# EasyEDA Pro project ProPrj_F446V2.0.epro, board PCB5
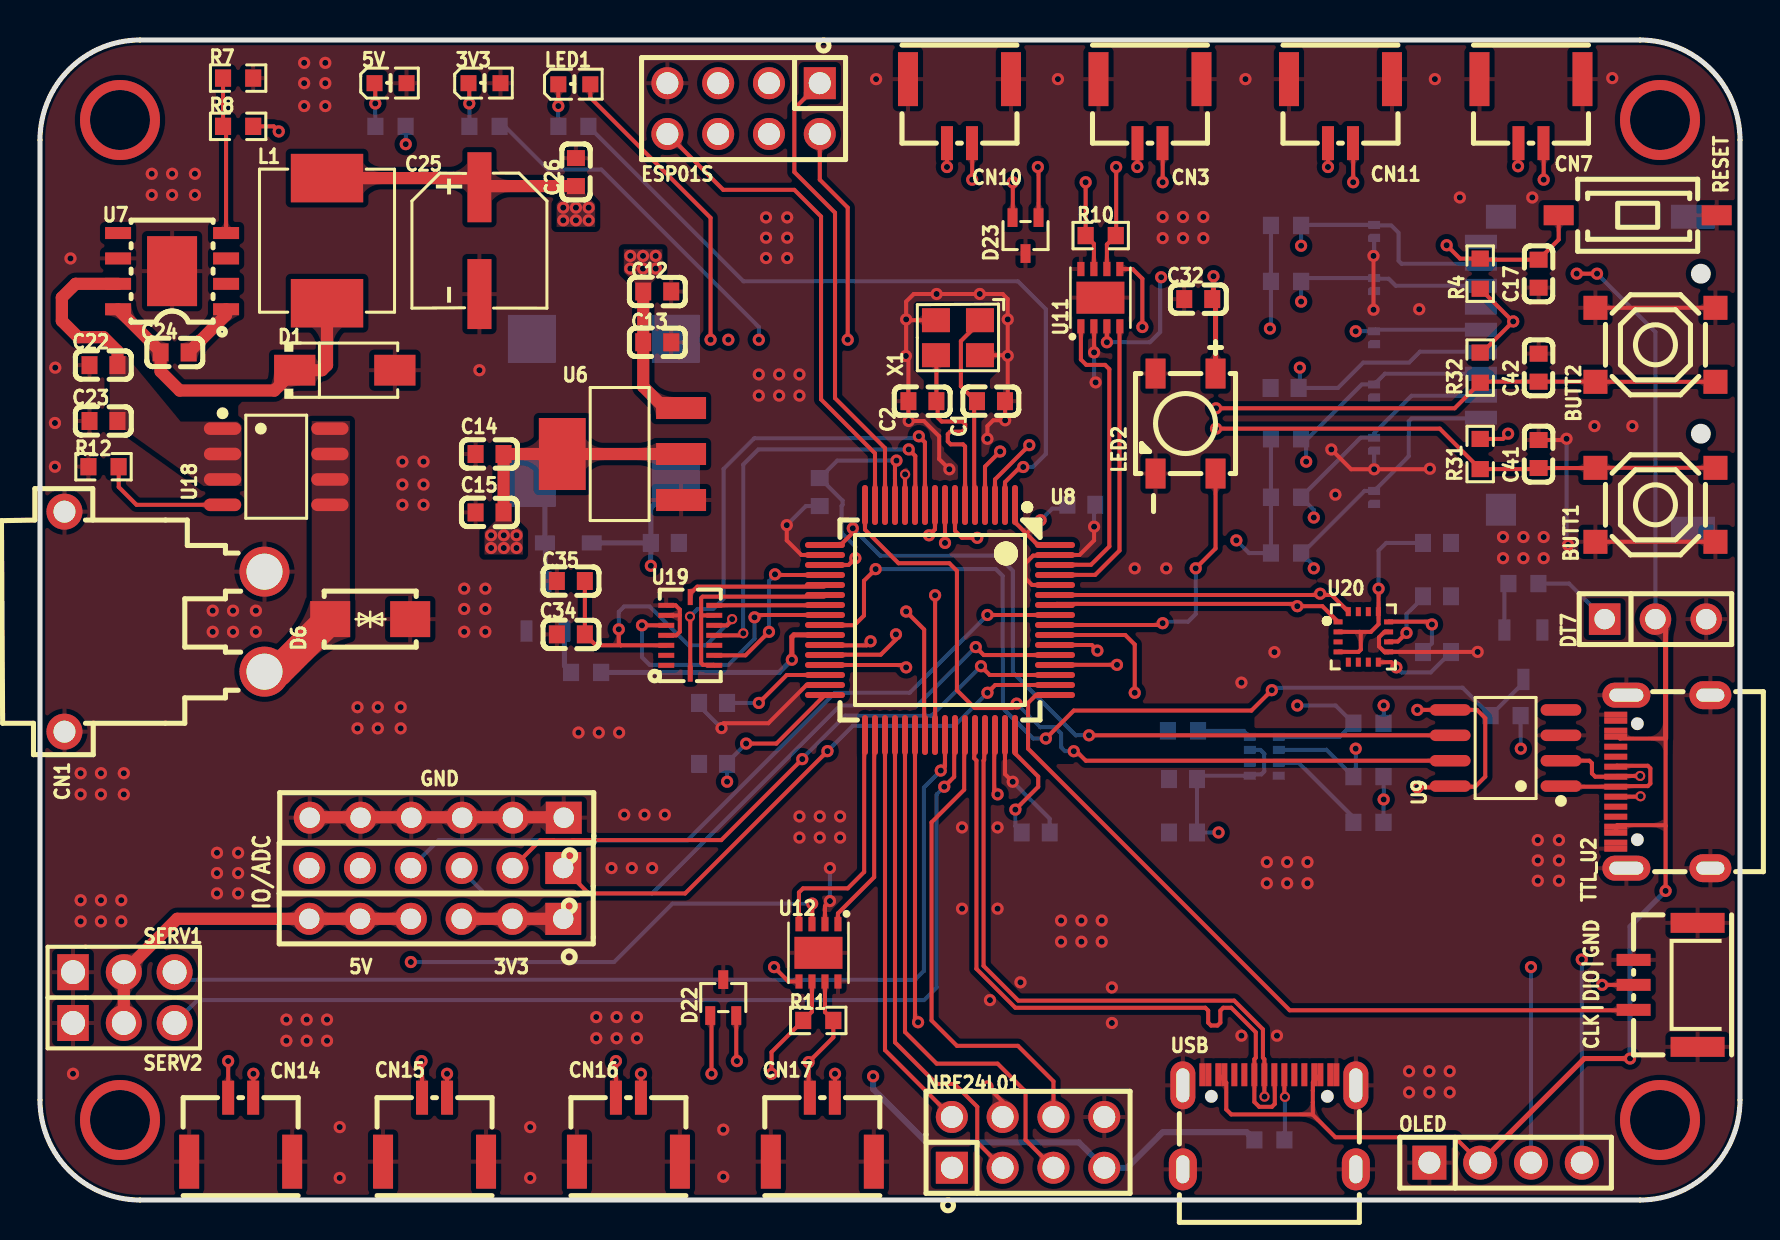
[diagram p1: board, top side]
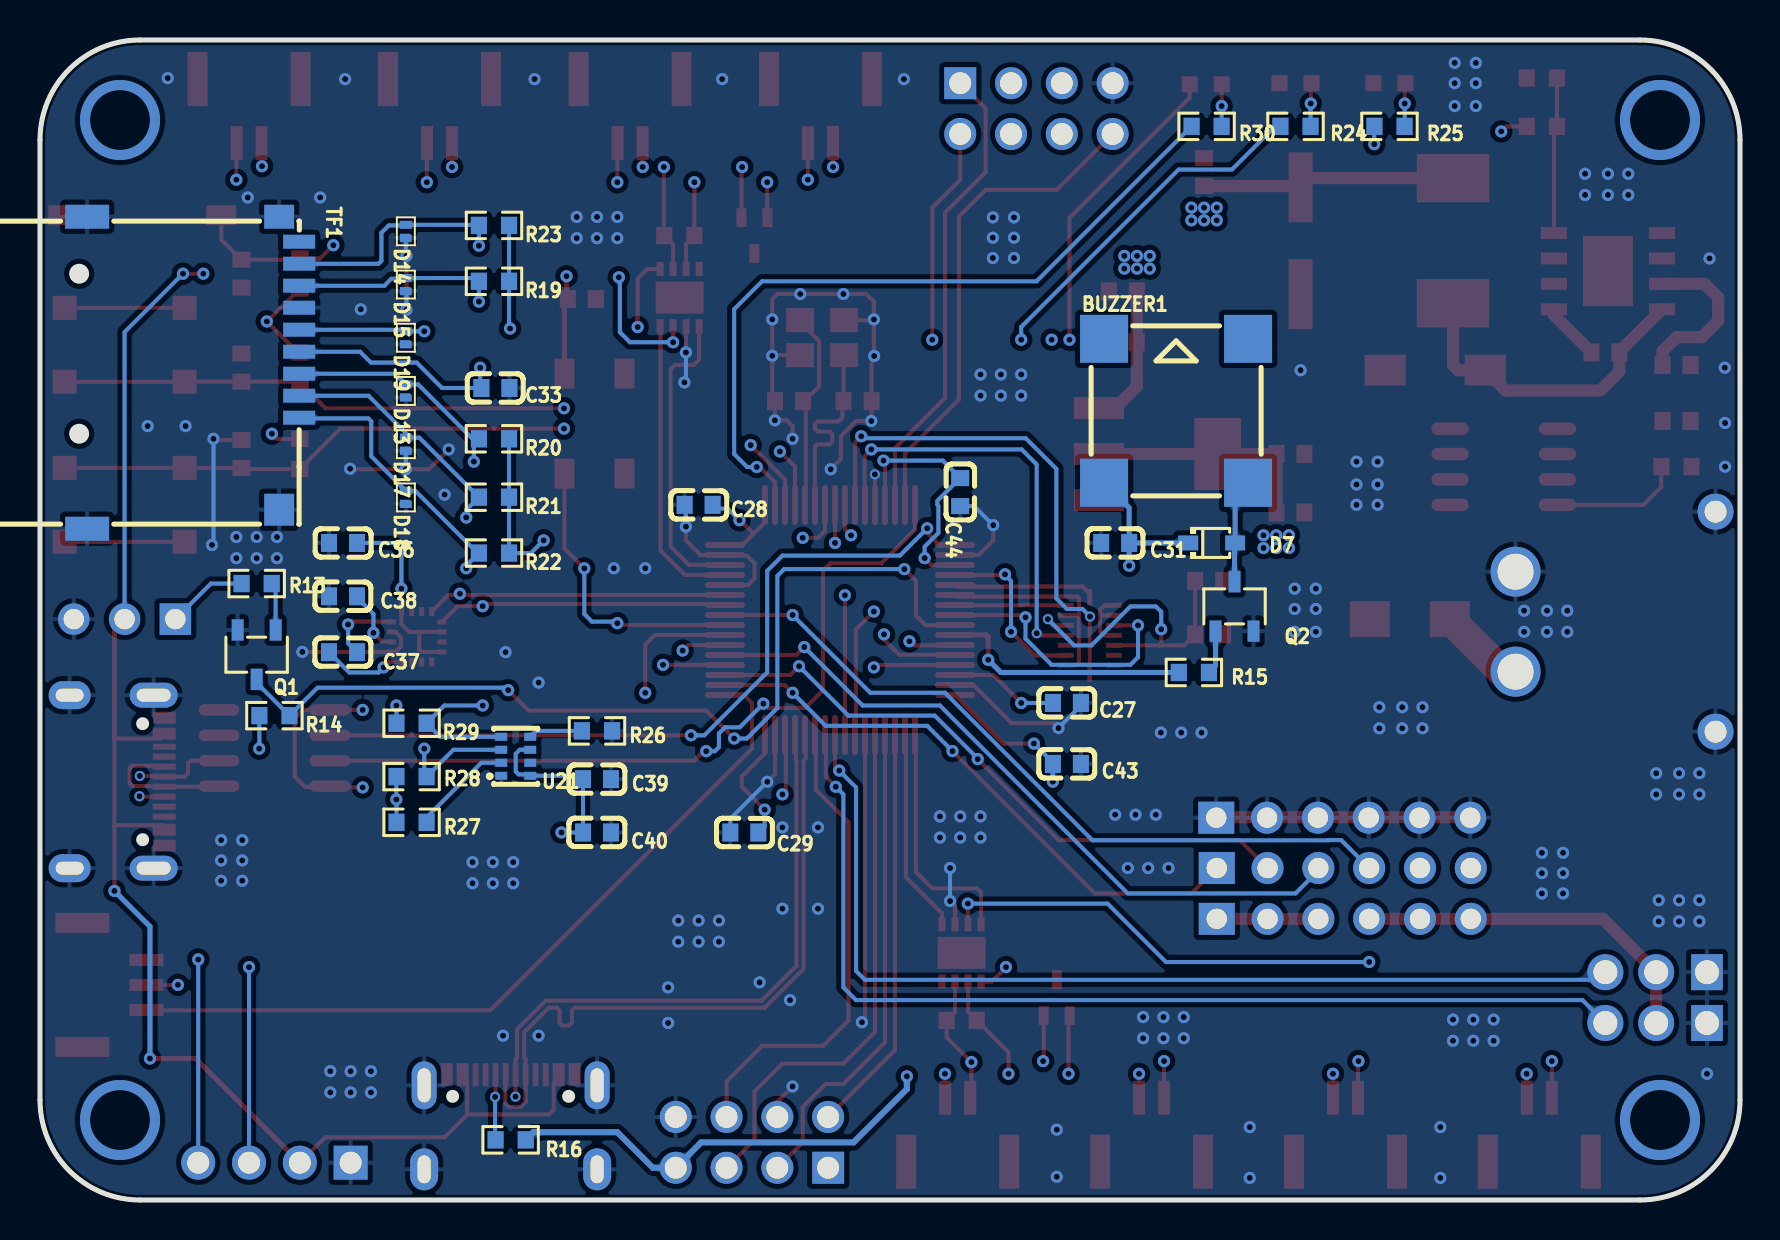
[diagram p2: board, bottom side, seen from below]

Outline 85 x 58 mm; copper layers: Top Layer, GND1, SIG, POW, GND2, Bottom Layer. Coordinates in mm from the lower left corner of the outline.
Outline path: 0,53 0,5 arc(1.46,1.46) 5,0 80,0 arc(83.54,1.46) 85,5 85,53 arc(83.54,56.54) 80,58 5,58 arc(1.46,56.54) 0,53
Stack: Top Layer 0.035mm 外层铜厚1oz / Dielectric1 0.0994mm 3313 RC57% 4.2mil / GND1 0.0152mm 内层铜厚 / Dielectric2 0.55mm 0.55mm H/H No copper / SIG 0.0152mm 内层铜厚 / Dielectric3 0.1088mm 2116 RC54% 4.9mil / POW 0.0152mm 内层铜厚 / Dielectric4 0.55mm 0.55mm H/H No copper / GND2 0.0152mm 内层铜厚 / Dielectric5 0.0994mm 3313 RC57% 4.2mil / Bottom Layer 0.035mm 外层铜厚1oz

## Design rules (mm)
net OSC_IN: osc
net OSC_OUT: osc
net USB_DP: usb
net USB_DM: usb
net TTL_DP: ttl
net TTL_DM: ttl
template: 自定义配置
spacing copperThickness1oz (default): track to track 0.102, other pairs 0.152 to 0.3
spacing copperThickness2oz: track to track 0.203, other pairs 0.152 to 0.3
track width copperThickness1oz (default): min 0.127, default 0.203, max 2.54
track width copperThickness2oz: min 0.203, default 0.254, max 2.54
differential pair differentialPair (default): width min 0.127, default 0.203, max 2.54; gap min 0.152, default 0.152
via viaSize (default): diameter min 0.406, default 0.61, max 10; hole min 0.305, default 0.305, max 6.299

## Placement (name value [footprint] x y rotation side)
3V3  -  [hdr-th_6p-p2.54-v-f]  19.84 19.11 180 top
3V3#2  -  [LED0603-R-RD_WHITE]  22.22 55.84 0 top
5V  -  [hdr-th_6p-p2.54-v-f]  19.81 14.06 180 top
5V#2  -  [LED0603-R-RD_WHITE]  17.53 55.84 0 top
BUTT1  SW-KEY轻触开关贴片四脚按键  [KEY-SMD_4P-L5.1-W5.1-P3.70-LS6.5]  80.77 34.76 0 top
BUTT2  SW-KEY轻触开关贴片四脚按键  [KEY-SMD_4P-L5.1-W5.1-P3.70-LS6.5]  80.77 42.76 180 top
BUZZER1  2.7kHz  [BUZ-SMD_4P-L8.5-W8.5-P8.50-BR]  28.19 39.46 180 bottom
C1  20pF  [C0603]  47.55 39.94 0 top
C2  20pF  [C0603]  44.12 39.94 0 top
C12  10uF  [C0603]  30.86 45.43 180 top
C13  100nF  [C0603]  30.86 42.89 180 top
C14  10uF  [C0603]  22.48 37.3 0 top
C15  100nF  [C0603]  22.48 34.38 0 top
C17  1uF  [C0603]  74.93 46.32 90 top
C22  100nF  [C0603]  3.17 41.74 0 top
C23  10uF  [C0603]  3.17 38.95 0 top
C24  100nF  [C0603]  6.73 42.38 180 top
C25  220uF  [CAP-SMD_BD6.3-L6.6-W6.6-LS7.2-FD]  21.97 47.97 270 top
C26  100nF  [C0603]  26.8 51.4 270 top
C27  2.2uF  [C0603]  33.66 24.85 180 bottom
C28  100nF  [C0603]  52.07 34.76 0 bottom
C29  100nF  [C0603]  49.78 18.38 0 bottom
C31  100nF  [C0603]  31.24 32.85 180 bottom
C32  100nF  [C0603]  57.91 45.05 180 top
C33  100nF  [C0603]  62.23 40.6 180 bottom
C34  100nF  [C0603]  26.54 28.28 180 top
C35  100nF  [C0603]  26.54 30.95 180 top
C36  100nF  [C0603]  69.85 32.85 0 bottom
C37  220nF  [C0603]  69.85 27.39 180 bottom
C38  10uF  [C0603]  69.85 30.19 180 bottom
C39  100nF  [C0603]  57.15 21.04 180 bottom
C40  100nF  [C0603]  57.15 18.38 180 bottom
C41  1uF  [C0603]  74.93 37.3 90 top
C42  1uF  [C0603]  74.93 41.62 90 top
C43  100nF  [C0603]  33.66 21.81 180 bottom
C44  100nF  [C0603]  38.99 35.39 270 bottom
CLK|DIO|GND  A1257WR-S-3P  [CONN-SMD_A1257WR-S-3P]  81.28 10.76 90 top
CN1  XT30PW-M  [CONN-TH_XT30PW-M]  6.22 28.92 270 top
CN3  A1257WR-S-2P  [CONN-SMD_A1257WR-S-2P]  55.5 54.44 180 top
CN7  A1257WR-S-2P  [CONN-SMD_A1257WR-S-2P]  74.55 54.44 180 top
CN10  A1257WR-S-2P  [CONN-SMD_A1257WR-S-2P]  45.97 54.44 180 top
CN11  A1257WR-S-2P  [CONN-SMD_A1257WR-S-2P]  65.02 54.44 180 top
CN14  A1257WR-S-2P  [CONN-SMD_A1257WR-S-2P]  10.03 3.52 0 top
CN15  A1257WR-S-2P  [CONN-SMD_A1257WR-S-2P]  19.73 3.52 0 top
CN16  A1257WR-S-2P  [CONN-SMD_A1257WR-S-2P]  29.42 3.52 0 top
CN17  A1257WR-S-2P  [CONN-SMD_A1257WR-S-2P]  39.12 3.52 0 top
D1  SS54  [SMA_L4.4-W2.8-LS5.4-R-RD]  15.24 41.49 0 top
D6  SMAJ28CA  [SMA_L4.3-W2.5-LS5.0-BI]  16.51 29.04 180 top
D7  IN4148WS  [SOD-323_L1.8-W1.3-LS2.5-RD]  26.42 32.85 180 bottom
D13  AZ5725-01F  [DFN-2L_L1.0-W0.6-P0.65-BI]  66.71 40.45 90 bottom
D14  AZ5725-01F  [DFN-2L_L1.0-W0.6-P0.65-BI]  66.71 48.43 90 bottom
D15  AZ5725-01F  [DFN-2L_L1.0-W0.6-P0.65-BI]  66.71 45.77 90 bottom
D17  AZ5725-01F  [DFN-2L_L1.0-W0.6-P0.65-BI]  66.71 37.79 90 bottom
D18  AZ5725-01F  [DFN-2L_L1.0-W0.6-P0.65-BI]  66.71 35.13 90 bottom
D19  AZ5725-01F  [DFN-2L_L1.0-W0.6-P0.65-BI]  66.71 43.11 90 bottom
D22  PESD1CAN-UX  [SOT-323-3_L2.0-W1.3-P1.30-LS2.1-BR]  34.16 10.12 270 top
D23  PESD1CAN-UX  [SOT-323-3_L2.0-W1.3-P1.30-LS2.1-BR]  49.28 48.22 90 top
DT7  PM254V-11-03-H85  [HDR-TH_3P-P2.54-V-F]  80.77 29.04 0 top
ESP01S  DS1023-2*4SF11  [HDR-TH_8P-P2.54-V-F-R2-C4-S2.54-1]  35.18 54.57 180 top
GND  -  [hdr-th_6p-p2.54-v-f]  19.81 16.6 180 top
L1  15uH  [IND-SMD_L7.0-W6.6_FXL0630]  14.35 47.97 270 top
LED1  KT-0805G  [LED0603-R-RD_WHITE]  26.72 55.78 0 top
LED2  XL-5050RGBC-WS2812B  [LED-SMD_4P-L5.0-W5.0-BL_XL-5050RGBC]  57.28 38.82 180 top
NRF24L01  DS1023-2*4SF11  [HDR-TH_8P-P2.54-V-F-R2-C4-S2.54-1]  49.4 2.88 0 top
OLED  2.54-1*4P母  [HDR-TH_4P-P2.54-V-F]  73.28 1.87 0 top
Q1  S8050  [SOT-23-3_L2.9-W1.6-P1.90-LS2.8-BR]  74.17 27.27 90 bottom
Q2  S8050  [SOT-23-3_L2.9-W1.6-P1.90-LS2.8-BR]  25.27 29.68 270 bottom
R4  10kΩ  [R0603]  72.01 46.32 270 top
R7  3.24K  [R0603]  9.91 56.09 0 top
R8  10kΩ  [R0603]  9.91 53.68 180 top
R10  120Ω  [R0603]  53.03 48.22 180 top
R11  120Ω  [R0603]  38.91 8.98 0 top
R12  4.7kΩ  [R0603]  3.17 36.66 180 top
R13  4.7kΩ  [R0603]  74.17 30.82 180 bottom
R14  4.7kΩ  [R0603]  73.28 24.22 0 bottom
R15  1kΩ  [R0603]  27.31 26.38 180 bottom
R16  4,7K  [R0603]  61.47 3.01 180 bottom
R19  10kΩ  [R0603]  62.3 45.94 0 bottom
R20  10kΩ  [R0603]  62.3 38.06 0 bottom
R21  10kΩ  [R0603]  62.3 35.14 0 bottom
R22  10kΩ  [R0603]  62.3 32.35 0 bottom
R23  10kΩ  [R0603]  62.3 48.73 0 bottom
R24  1kΩ  [R0603]  22.22 53.68 180 bottom
R25  4.7kΩ  [R0603]  17.53 53.68 180 bottom
R26  10kΩ  [R0603]  57.15 23.46 180 bottom
R27  10kΩ  [R0603]  66.42 18.88 180 bottom
R28  4.7kΩ  [R0603]  66.42 21.17 0 bottom
R29  4.7kΩ  [R0603]  66.42 23.84 0 bottom
R30  1kΩ  [R0603]  26.67 53.68 180 bottom
R31  10kΩ  [R0603]  72.01 37.3 90 top
R32  10kΩ  [R0603]  72.01 41.62 90 top
RESET  轻触按键 3x6x2.5mm  [SW-SMD_L6.0-W3.6-LS8.0]  79.88 49.24 0 top
SERV1  2.54-1*3P针  [HDR-TH_3P-P2.54-V-M-1]  4.19 11.39 0 top
SERV2  2.54-1*3P针  [HDR-TH_3P-P2.54-V-M-1]  4.19 8.85 0 top
TF1  TF-012  [TF-SMD_TF-012]  77.34 41.36 270 bottom
TTL_U2  TYPE-C16PIN母座 板上四脚三次molding  [USB-SMD_TYPE-C16PIN]  81.15 20.92 90 top
U6  AMS1117-3.3  [SOT-223-3_L6.5-W3.4-P2.30-LS7.0-BR]  29.08 37.3 0 top
U7  TPS5430DDAR  [ESOP-8_L4.9-W3.9-P1.27-LS6.0-TL-EP]  6.6 46.44 180 top
U8  STM32F446RET6  [LQFP-64_L10.0-W10.0-P0.50-LS12.0-BL]  45 29 180 top
U9  CH340N  [SOP-8_L5.0-W4.0-P1.27-LS6.0-BL]  73.28 22.6 90 top
U11  TJA1044GTK/3Z  [HVSON-8_L3.0-W3.0-P0.65-BL-EP]  53.02 45.12 0 top
U12  TJA1044GTK/3Z  [HVSON-8_L3.0-W3.0-P0.65-BL-EP]  38.92 12.36 180 top
U18  AO4441(UMW)  [SOP-8_L4.9-W3.9-P1.27-LS6.0-BL]  11.81 36.66 270 top
U19  BMI088  [LGA-16_L4.5-W3.0-P0.50-BL]  32.51 28.23 0 top
U20  QMC5883L  [LGA-16_L3.0-W3.0-P0.50-BL_SQ]  66.17 28.16 270 top
U21  BMP280  [LGA-8_L2.5-W2.0-P0.65_AMP6127]  61.21 22.19 0 bottom
USB  TYPE-C16PIN母座 板上四脚三次molding  [USB-SMD_TYPE-C16PIN]  61.47 3.9 0 top
X1  12MHz  [OSC-SMD_4P-L3.2-W2.5-BL]  45.9 43.12 180 top

## Footprints (pads in the part's own frame, mm; a bottom-side part is the same pattern mirrored in y, then rotated)
BUZ-SMD_4P-L8.5-W8.5-P8.50-BR
  rect 2.4x2.4 smd: 1(-3.6,-3.6) 2(3.6,-3.6) 3(3.599,3.599) 4(-3.6,3.6)
C0603
  rect 0.8x0.9 smd: 1(-0.7,0) 2(0.7,0)
CAP-SMD_BD6.3-L6.6-W6.6-LS7.2-FD
  rect 3.5x1.2 smd: 1(-2.67,0) 2(2.67,0)
CONN-SMD_A1257WR-S-2P
  rect 0.6x1.7 smd: 1(0.625,1.6) 2(-0.625,1.6)
  rect 1x2.7 smd: 3(2.575,-1.6) 4(-2.575,-1.6)
CONN-SMD_A1257WR-S-3P
  rect 0.6x1.7 smd: 1(1.25,1.6) 2(0,1.6) 3(-1.25,1.6)
  rect 1x2.7 smd: 4(3.1,-1.6) 5(-3.1,-1.6)
CONN-TH_XT30PW-M
  round 2.5 hole 1.8: 1(-2.5,5) 2(2.5,5)
  round 1.8 hole 1.1: 3(5.5,-5) 4(-5.5,-5)
DFN-2L_L1.0-W0.6-P0.65-BI
  custom 0.41x0.6 smd: 1(-0.325,0)
  rect 0.4x0.6 smd: 2(0.325,0)
ESOP-8_L4.9-W3.9-P1.27-LS6.0-TL-EP
  rect 1.3x0.6 smd: 1(-2.7,1.905) 2(-2.7,0.635) 3(-2.7,-0.635) 4(-2.7,-1.905) 5(2.7,-1.905) 6(2.7,-0.635) 7(2.7,0.635) 8(2.7,1.905)
  rect 2.5x3.5 smd: 9(0,0)
HDR-TH_3P-P2.54-V-F
  rect 1.575x1.575 hole 1.02: 1(-2.54,0)
  round 1.575 hole 1.02: 2(0,0) 3(2.54,0)
HDR-TH_3P-P2.54-V-M-1
  rect 1.575x1.8 hole 1.2: 1(-2.54,0)
  round 1.8 hole 1.2: 2(0,0) 3(2.54,0)
HDR-TH_4P-P2.54-V-F
  rect 1.7x1.7 hole 1.1: 1(-3.81,0)
  round 1.7 hole 1.1: 2(-1.27,0) 3(1.27,0) 4(3.81,0)
hdr-th_6p-p2.54-v-f
  rect 1.8x1.6 hole 1.02: 1(-6.35,0)
  round 1.6 hole 1.02: 2(-3.81,0) 3(-1.27,0) 4(1.27,0) 5(3.81,0) 6(6.35,0)
HDR-TH_8P-P2.54-V-F-R2-C4-S2.54-1
  rect 1.6x1.6 hole 1.1: 1(-3.81,-1.27)
  round 1.6 hole 1.1: 2(-3.81,1.27) 3(-1.27,-1.27) 4(-1.27,1.27) 5(1.27,-1.27) 6(1.27,1.27) 7(3.81,-1.27) 8(3.81,1.27)
HVSON-8_L3.0-W3.0-P0.65-BL-EP
  rect 0.355x0.711 smd: 1(-0.975,-1.433) 2(-0.325,-1.433) 3(0.325,-1.433) 4(0.975,-1.433) 5(0.975,1.433) 6(0.325,1.433) 7(-0.325,1.433) 8(-0.975,1.433)
  rect 2.4x1.6 smd: 9(0,0)
IND-SMD_L7.0-W6.6_FXL0630
  rect 2.424x3.62 smd: 1(3.128,0) 2(-3.128,0)
KEY-SMD_4P-L5.1-W5.1-P3.70-LS6.5
  rect 1.2x1.2 smd: 1(-3,1.85) 2(3,1.85) 3(-3,-1.85) 4(3,-1.85)
LED0603-R-RD_WHITE
  rect 0.8x0.8 smd: 1(0.8,0) 2(-0.8,0)
LED-SMD_4P-L5.0-W5.0-BL_XL-5050RGBC
  rect 1x1.5 smd: 1(-1.5,-2.5) 2(1.5,-2.5) 3(1.5,2.5) 4(-1.5,2.5)
LGA-8_L2.5-W2.0-P0.65_AMP6127
  rect 0.6x0.4 smd: 1(0.725,0.975) 2(0.725,0.325) 3(0.725,-0.325) 4(0.725,-0.975) 5(-0.725,-0.975) 6(-0.725,-0.325) 7(-0.725,0.325) 8(-0.725,0.975)
LGA-16_L3.0-W3.0-P0.50-BL_SQ
  rect 0.25x0.45 smd: 1(-0.75,-1.263) 2(-0.25,-1.263) 3(0.25,-1.263) 4(0.75,-1.263) 9(0.75,1.263) 10(0.25,1.263) 11(-0.25,1.263) 12(-0.75,1.263)
  rect 0.45x0.25 smd: 5(1.263,-0.75) 6(1.263,-0.25) 7(1.263,0.25) 8(1.263,0.75) 13(-1.263,0.75) 14(-1.263,0.25) 15(-1.263,-0.25) 16(-1.263,-0.75)
LGA-16_L4.5-W3.0-P0.50-BL
  rect 0.8x0.25 smd: 1(-1.2,-1.498) 2(-1.2,-0.998) 3(-1.2,-0.498) 4(-1.2,0.002) 5(-1.2,0.502) 6(-1.2,1.002) 7(-1.2,1.502) 9(1.2,1.502) 10(1.2,1.002) 11(1.2,0.502) 12(1.2,0.002) 13(1.2,-0.498) 14(1.2,-0.998) 15(1.2,-1.498)
  rect 0.25x0.8 smd: 8(0,1.915) 16(0,-1.915)
LQFP-64_L10.0-W10.0-P0.50-LS12.0-BL
  oval 0.3x2 smd: 1(-3.75,-5.75) 2(-3.25,-5.75) 3(-2.75,-5.75) 4(-2.25,-5.75) 5(-1.75,-5.75) 6(-1.25,-5.75) 7(-0.75,-5.75) 8(-0.25,-5.75) 9(0.25,-5.75) 10(0.75,-5.75) 11(1.25,-5.75) 12(1.75,-5.75) 13(2.25,-5.75) 14(2.75,-5.75) 15(3.25,-5.75) 16(3.75,-5.75) 33(3.75,5.75) 34(3.25,5.75) 35(2.75,5.75) 36(2.25,5.75) 37(1.75,5.75) 38(1.25,5.75) 39(0.75,5.75) 40(0.25,5.75) 41(-0.25,5.75) 42(-0.75,5.75) 43(-1.25,5.75) 44(-1.75,5.75) 45(-2.25,5.75) 46(-2.75,5.75) 47(-3.25,5.75) 48(-3.75,5.75)
  oval 2x0.3 smd: 17(5.75,-3.75) 18(5.75,-3.25) 19(5.75,-2.75) 20(5.75,-2.25) 21(5.75,-1.75) 22(5.75,-1.25) 23(5.75,-0.75) 24(5.75,-0.25) 25(5.75,0.25) 26(5.75,0.75) 27(5.75,1.25) 28(5.75,1.75) 29(5.75,2.25) 30(5.75,2.75) 31(5.75,3.25) 32(5.75,3.75) 49(-5.75,3.75) 50(-5.75,3.25) 51(-5.75,2.75) 52(-5.75,2.25) 53(-5.75,1.75) 54(-5.75,1.25) 55(-5.75,0.75) 56(-5.75,0.25) 57(-5.75,-0.25) 58(-5.75,-0.75) 59(-5.75,-1.25) 60(-5.75,-1.75) 61(-5.75,-2.25) 62(-5.75,-2.75) 63(-5.75,-3.25) 64(-5.75,-3.75)
OSC-SMD_4P-L3.2-W2.5-BL
  rect 1.4x1.2 smd: 1(-1.1,-0.875) 2(1.1,-0.875) 3(1.1,0.875) 4(-1.1,0.875)
R0603
  rect 0.806x0.864 smd: 1(-0.753,0) 2(0.753,0)
SMA_L4.3-W2.5-LS5.0-BI
  rect 2x1.8 smd: 1(-2,0) 2(2,0)
SMA_L4.4-W2.8-LS5.4-R-RD
  rect 2.062x1.539 smd: 1(2.503,0) 2(-2.503,0)
SOD-323_L1.8-W1.3-LS2.5-RD
  rect 1x0.75 smd: 1(-1.173,0) 2(1.173,0)
SOP-8_L4.9-W3.9-P1.27-LS6.0-BL
  oval 0.63x1.865 smd: 1(-1.905,-2.683) 2(-0.635,-2.683) 3(0.635,-2.683) 4(1.905,-2.683) 5(1.905,2.683) 6(0.635,2.683) 7(-0.635,2.683) 8(-1.905,2.683)
SOP-8_L5.0-W4.0-P1.27-LS6.0-BL
  oval 0.574x2.035 smd: 1(-1.905,-2.768) 2(-0.635,-2.768) 3(0.635,-2.768) 4(1.905,-2.768) 5(1.905,2.768) 6(0.635,2.768) 7(-0.635,2.768) 8(-1.905,2.768)
SOT-23-3_L2.9-W1.6-P1.90-LS2.8-BR
  rect 1.07x0.6 smd: 1(1.235,-0.95) 2(1.235,0.95) 3(-1.235,0)
SOT-223-3_L6.5-W3.4-P2.30-LS7.0-BR
  rect 2.5x1.1 smd: 1(2.97,-2.3) 2(2.97,0) 3(2.97,2.3)
  rect 2.34x3.6 smd: 4(-2.97,0)
SOT-323-3_L2.0-W1.3-P1.30-LS2.1-BR
  rect 0.936x0.5 smd: 1(0.898,-0.65) 2(0.898,0.65) 3(-0.898,0)
SW-SMD_L6.0-W3.6-LS8.0
  rect 1.5x1 smd: 1(-3.95,0) 2(3.95,0)
TF-SMD_TF-012
  rect 0.7x1.6 smd: 1(2.25,5.3) 2(1.15,5.3) 3(0.05,5.3) 4(-1.05,5.3) 5(-2.15,5.3) 6(-3.25,5.3) 7(-4.35,5.3) 8(-5.45,5.3) CD(-6.55,5.3)
  rect 1.2x1.5 smd: 10(-7.8,4.3)
  rect 1.2x2.2 smd: 11(-7.8,-5.3) 12(7.8,-5.3)
  rect 1.6x1.5 smd: 13(6.85,4.3)
USB-SMD_TYPE-C16PIN
  oval 1.25x2.4 hole 0.65x1.7: 17(-4.325,1.835) 18(4.325,1.835)
  oval 1.4x2.1 hole 0.65x1.4: 19(-4.325,-2.365) 20(4.325,-2.365)
  rect 0.3x1.15 smd: A1(-3.35,2.365) A4(-2.55,2.365) A5(-1.25,2.365) A6(-0.25,2.365) A7(0.25,2.365) A8(1.25,2.365) A9(2.55,2.365) A12(3.35,2.365) B1(3.05,2.365) B4(2.25,2.365) B5(1.75,2.365) B6(0.75,2.365) B7(-0.75,2.365) B8(-1.75,2.365) B9(-2.25,2.365) B12(-3.05,2.365)

## Nets
+5V: 5V.4 5V.5 5V.6 C12.2 C13.2 C25.1 C26.2 C32.1 DT7.2 L1.2 LED2.1 OLED.2 R8.1 R25.1 SERV1.2 SERV2.2 TTL_U2.A4 TTL_U2.A9 TTL_U2.B4 TTL_U2.B9 U6.3 U11.3 U12.3 USB.A4 USB.A9 USB.B4 USB.B9
GND: 3V3.1 3V3.2 3V3.3 3V3.4 3V3.5 3V3.6 3V3#2.1 5V#2.1 BUTT1.3 BUTT1.4 BUTT2.3 BUTT2.4 C1.2 C2.1 C12.1 C13.1 C14.1 C15.1 C17.1 C22.1 C23.1 C25.2 C26.1 C27.2 C28.2 C29.2 C31.1 C32.2 C33.2 C34.2 C35.2 C36.2 C38.1 C39.2 C40.2 C41.2 C42.2 C43.2 C44.2 CLK|DIO|GND.1 CLK|DIO|GND.4 CLK|DIO|GND.5 CN1.1 CN1.3 CN1.4 CN3.3 CN3.4 CN7.3 CN7.4 CN10.3 CN10.4 CN11.3 CN11.4 CN14.3 CN14.4 CN15.3 CN15.4 CN16.3 CN16.4 CN17.3 CN17.4 D1.1 D6.1 D13.1 D14.1 D15.1 D17.1 D18.1 D19.1 D22.3 D23.3 DT7.3 ESP01S.7 LED2.2 LED2.3 NRF24L01.8 OLED.1 Q1.2 Q2.2 R7.2 R12.2 R26.2 RESET.2 SERV1.1 SERV2.1 TF1.6 TF1.10 TF1.11 TF1.12 TF1.13 TTL_U2.17 TTL_U2.18 TTL_U2.19 TTL_U2.20 TTL_U2.A1 TTL_U2.A12 TTL_U2.B1 TTL_U2.B12 U6.1 U7.6 U7.9 U8.12 U8.18 U8.31 U8.47 U8.60 U8.63 U9.3 U11.2 U11.8 U11.9 U12.2 U12.8 U12.9 U19.4 U19.6 U19.7 U20.9 U20.11 U21.1 U21.7 USB.17 USB.18 USB.19 USB.20 USB.A1 USB.A12 USB.B1 USB.B12 X1.2 X1.4
VCC3V3: 5V.1 5V.2 5V.3 BUZZER1.1 C14.2 C15.2 C28.1 C29.1 C31.2 C33.1 C34.1 C35.1 C36.1 C39.1 C40.1 C43.1 C44.1 D7.1 ESP01S.2 LED1.1 NRF24L01.7 R4.2 R14.2 R16.2 R19.1 R20.1 R21.1 R22.1 R23.1 R24.1 R27.1 R28.2 R29.2 R31.2 R32.2 TF1.4 U6.2 U6.4 U8.1 U8.13 U8.19 U8.32 U8.48 U8.64 U9.5 U9.8 U11.5 U12.5 U19.3 U19.11 U20.2 U20.4 U20.13 U21.6 U21.8
VCC24V: C22.2 C23.2 U7.7 U18.1 U18.2 U18.3
ACCEL_CS: U8.20 U19.14
ACCEL_INT: U8.10 U19.16
ADC_IN1: GND.5 U8.8
ADC_IN2: GND.6 U8.9
BMI088_MISO: U8.22 U19.10 U19.15
BMI088_MOSI: U8.23 U19.9
BMI088_SCK: U8.21 U19.8
BUTT1: BUTT1.1 BUTT1.2 C41.1 R31.1 U8.3
BUTT2: BUTT2.1 BUTT2.2 C42.1 R32.1 U8.4
BUZZ: R15.1 U8.26
CAN1_H: CN3.2 CN7.2 CN10.2 CN11.2 D23.2 R10.2 U11.7
CAN1_L: CN3.1 CN7.1 CN10.1 CN11.1 D23.1 R10.1 U11.6
CAN1_RX: U8.61 U11.4
CAN1_TX: U8.62 U11.1
CAN2_H: CN14.2 CN15.2 CN16.2 CN17.2 D22.2 R11.2 U12.7
CAN2_L: CN14.1 CN15.1 CN16.1 CN17.1 D22.1 R11.1 U12.6
CAN2_RX: U8.33 U12.4
CAN2_TX: U8.34 U12.1
GYRO_CS: U8.24 U19.5
GYRO_INT: U8.11 U19.12
IMU_SCL: R29.1 U8.58 U20.1 U21.4
IMU_SDA: R28.1 U8.59 U20.16 U21.3
IO1: GND.2 U8.51
IO2: GND.1 U8.50
IO3: GND.3 U8.53
IO4: GND.4 U8.57
LED1: R30.1 U8.2
NRST: C17.2 R4.1 RESET.1 U8.7
OLED_SCL: OLED.3 U8.29
OLED_SDA: OLED.4 U8.55
OSC_IN: C1.1 U8.5 X1.1
OSC_OUT: C2.2 U8.6 X1.3
POWER: CN1.2 D6.2 U18.5 U18.6 U18.7 U18.8
SDIO_CK: D19.2 TF1.5 U8.28
SDIO_CMD: D13.2 R20.2 TF1.3 U8.54
SDIO_D0: D15.2 R19.2 TF1.7 U8.39
SDIO_D1: D14.2 R23.2 TF1.8 U8.40
SDIO_D2: D18.2 R22.2 TF1.1 U8.27
SDIO_D3: D17.2 R21.2 TF1.2 U8.52
SERVO1: SERV1.3 U8.41
SERVO2: SERV2.3 U8.42
SPI2_CE: NRF24L01.6 U8.43
SPI2_CLK: NRF24L01.4 U8.38
SPI2_CSN: NRF24L01.5 U8.37
SPI2_MISO: NRF24L01.2 U8.35
SPI2_MOSI: NRF24L01.3 U8.36
SWCLK: CLK|DIO|GND.3 U8.49
SWDIO: CLK|DIO|GND.2 U8.46
TTL_DM: TTL_U2.A7 TTL_U2.B7 U9.2
TTL_DP: TTL_U2.A6 TTL_U2.B6 U9.1
UART4_RX_ESP: ESP01S.8 U8.15
UART4_TX_ESP: ESP01S.1 U8.14
USART2_RX: U8.17 U9.6
USART2_TX: U8.16 U9.7
USART3_RX_DT7: Q1.3 R14.1 U8.25
USB_DM: U8.44 USB.A7 USB.B7
USB_DP: R16.1 U8.45 USB.A6 USB.B6
WS2812: LED2.4 U8.56
$3N10170: C24.1 U7.1
$3N10572: C24.2 D1.2 L1.1 U7.8
$3N10716: R7.1 R8.2 U7.4
$3N11994: C27.1 U8.30
$3N17339: R12.1 U18.4
$3N17600: DT7.1 R13.1
$3N17601: Q1.1 R13.2
$3N17854: BUZZER1.2 D7.2 Q2.3
$3N17986: Q2.1 R15.2
$3N19919: 3V3#2.2 R24.2
$3N19978: 5V#2.2 R25.2
$3N20666: C37.2 U20.12
$3N20667: C37.1 U20.8
$3N20697: C38.2 U20.10
$3N20825: R26.1 U21.5
$3N21033: R27.2 U21.2
$3N21210: LED1.2 R30.2

Pads without a net: BUZZER1 3 4; ESP01S 3 4 5 6; NRF24L01 1; TF1 CD; TTL_U2 A5 A8 B5 B8; U7 2 3 5; U9 4; U19 1 2 13; U20 3 5 6 7 14 15; USB A5 A8 B5 B8

## Via types
v1: diameter 4, hole 3, Top Layer to Bottom Layer, 4 vias
v2: diameter 0.61, hole 0.305, Top Layer to Bottom Layer, 335 vias
v3: diameter 0.508, hole 0.305, Top Layer to Bottom Layer, 8 vias

## Routing (per net, layer and track width the routed paths; a pad name or vN(x,y) marks a point on that pad's centre or on a via; arc(x,y) is an arc through that point)
+5V: length 149
  Top Layer w0.203: v2(38.61,14.82) 38.61,13.8 U12.3 ; TTL_U2.B4 78.9,23.17 79,23.07 81.28,23.07 81.28,18.71 ; 63.63,4.28 59.56,4.28 59.31,4.53 59.31,5.87 USB.A4 ; 63.63,4.28 64.77,3.14 70.74,3.14 OLED.2 ; 63.63,4.28 63.64,4.28 63.64,4.88 63.64,4.88 63.64,5.48 63.64,5.49 63.64,5.89 USB.A9 ; 81.28,18.71 v2(81.28,15.45) ; 81.28,18.71 81.25,18.74 78.86,18.74 TTL_U2.B9 TTL_U2.A4 ; v2(77.85,46.32) v2(76.84,46.32) ; v2(11.94,53.43) 11.68,53.68 R8.1 ; U11.3 v2(53.34,42.89)
  Top Layer w0.254: LED2.1 58.78,44.88 C32.1 58.67,45.11 v2(58.67,46.19) ; 81.28,23.07 81.28,28.54 DT7.2 ; OLED.2 77.22,7.07 v2(79.5,7.07)
  Top Layer w0.61: SERV2.2 SERV1.2 6.86,14.06 5V.6 5V.5 5V.4 ; U6.3 31.23,39.6 30.16,40.67 C13.2 C12.2 ; C26.2 22.03,50.7 C25.1 21.51,51.09 L1.2
  Bottom Layer w0.203: v2(18.29,52.79) 18.29,53.67 R25.1 ; DT7.2 80.77,43.39 v2(77.85,46.32) ; v2(18.54,11.9) 28.7,11.9 31.62,14.82 v2(38.61,14.82) ; v2(56.06,46.14) 56.01,46.09 56.01,43.39 55.5,42.89 v2(53.34,42.89)
  Bottom Layer w0.254: v2(81.28,15.45) 79.5,13.68 v2(79.5,7.07)
  vias: v2(26.16,49.62) v2(26.16,48.98) v2(26.8,49.62) v2(26.8,48.98) v2(27.43,49.62) v2(27.43,48.98) v2(29.51,47.2) v2(29.51,46.57) v2(30.15,47.2) v2(30.15,46.57) v2(30.78,47.2) v2(30.78,46.57)
GND: length 111.6
  Top Layer w0.203: v2(71.88,27.41) U20.9 67.42,27.39 67.23,27.39 66.95,27.67 66.95,28.14 67.22,28.41 U20.11 ; 31.99,29.23 31.99,29.52 31.78,29.73 31.31,29.73 ; 31.99,29.23 31.99,28.41 31.82,28.23 U19.4 ; 31.99,29.23 U19.6 ; v2(52.71,42.38) 52.71,43.67 U11.2 ; v2(52.71,33.67) 52.71,32.98 51.97,32.25 U8.63 50.72,32.22 49.66,32.22 49.28,31.84 49.28,31.08 49.6,30.75 U8.60 ; U8.31 38.33,25.75 36.42,23.84 34.18,23.84 34.08,23.73 v2(34.08,23.59) ; X1.4 48.36,42.24 v2(48.39,42.21) ; X1.2 43.35,43.99 v2(43.31,44.03) ; v2(43.31,44.03) 43.31,42.22 v2(43.29,42.2) 43.42,42.07 C2.1 43.42,38.96 v2(43.43,38.95) 44.2,38.95 44.96,38.19 44.96,37.05 v2(45.47,36.54) ; v2(43.31,44.03) 43.31,44.92 43.69,45.3 v2(44.83,45.3) v2(46.99,45.3) 48.13,45.3 48.39,45.05 v2(48.39,44.03) v2(48.39,42.21) ; v2(39.5,14.95) 39.25,14.7 U12.2 ; U8.18 38.07,32.25 37.34,32.98 v2(37.34,33.74) ; BUTT2.4 BUTT2.3 ; U8.47 48.25,21.3 v2(48.64,20.91) ; v2(47.37,38.06) 47.37,38.7 47.66,38.99 v2(48.26,38.99) 48.26,39.93 C1.2 48.39,40.08 v2(48.39,42.21) ; v3(43.26,36.28) 43.25,36.28 U8.12 ; v2(64.57,37.53) 65.56,36.54 v2(66.71,36.54) 69.47,36.54 v2(69.49,36.56) ; C41.2 76.26,38 v2(76.33,38.06) ; v2(66.68,47.2) v2(66.68,44.51) ; BUTT1.3 BUTT1.4
  Top Layer w0.61: 13.46,19.14 26.16,19.14
  Bottom Layer w0.203: C28.2 52.71,34.69 v2(52.71,33.67) ; v2(34.08,23.59) 32.96,24.72 C27.2 ; v2(66.68,47.2) 66.71,47.24 D14.1 ; v2(76.33,38.06) 76.33,32.78 76.35,32.75 v2(76.4,32.75) ; v2(66.68,44.51) 66.68,45.42 D15.1 ; D17.1 v2(66.71,36.54) ; v2(52.71,42.38) 52.71,40.91 52.73,40.88 v2(52.78,40.88) ; C29.2 50.48,19.06 v2(48.64,20.91) ; C44.2 38.29,34.69 v2(37.34,33.74) ; v2(39.5,14.95) v2(39.5,16.6)
  vias: v2(0.75,38.85) v2(0.75,36.66) v2(0.76,41.62) v2(1.52,47.08) v2(1.65,6.31) v2(2.03,21.34) v2(2.03,20.28) v2(2.03,14.99) v2(2.03,13.93) v2(3.05,21.34) v2(3.05,20.28) v2(3.05,14.99) v2(3.05,13.93) v2(4.06,14.99) v2(4.06,13.93) v2(4.19,21.34) v2(4.19,20.28) v2(5.59,51.31) v2(5.59,50.25) v2(6.6,51.31) v2(6.6,50.25) v2(7.75,51.31) v2(7.75,50.25) v2(8.64,29.47) v2(8.64,28.41) v2(8.85,17.36) v2(8.85,16.34) v2(8.85,15.33) v2(9.65,29.47) v2(9.65,28.41) v2(9.91,17.36) v2(9.91,16.34) v2(9.91,15.33) v2(10.8,29.47) v2(10.8,28.41) v2(12.32,9.02) v2(12.32,7.96) v2(13.21,56.86) v2(13.21,55.84) v2(13.21,54.7) v2(13.33,9.02) v2(13.33,7.96) v2(14.27,56.86) v2(14.27,55.84) v2(14.27,54.7) v2(14.35,9.02) v2(14.35,7.96) v2(14.99,3.64) v2(14.99,1.1) v2(15.88,24.64) v2(15.88,23.58) v2(16.89,24.64) v2(16.89,23.58) v2(18.03,24.64) v2(18.03,23.58) v2(18.12,36.92) v2(18.12,35.78) v2(18.12,34.76) v2(19.18,36.92) v2(19.18,35.78) v2(19.18,34.76) v2(21.21,30.57) v2(21.21,29.55) v2(21.21,28.41) v2(21.97,41.49) v2(22.27,30.57) v2(22.27,29.55) v2(22.27,28.41) v2(24.51,3.64) v2(24.51,1.1) v2(26.92,23.37) v2(27.81,9.15) v2(27.81,8.09) v2(27.94,23.37) v2(28.57,16.6) v2(28.83,9.15) v2(28.83,8.09) v2(28.96,23.37) v2(29.21,19.27) v2(29.59,16.6) v2(29.84,9.15) v2(29.84,8.09) v2(30.23,19.27) v2(30.61,16.6) v2(31.24,19.27) v2(34.16,3.52) v2(34.16,1.16) v2(35.94,41.28) v2(35.94,40.22) v2(36.3,49.13) v2(36.3,48.11) v2(36.3,47.1) v2(36.96,41.28) v2(36.96,40.22) v2(37.36,49.13) v2(37.36,48.11) v2(37.36,47.1) v2(37.97,41.28) v2(37.97,40.22) v2(37.97,19.18) v2(37.97,18.12) v2(38.99,19.18) v2(38.99,18.12) v2(40,19.18) v2(40,18.12) v2(41.8,56.04) v2(46.1,18.63) v2(46.1,14.57) v2(47.5,9.99) v2(47.88,18.63) v2(47.88,14.57) v2(49.02,10.88) v2(50.9,56.04) v2(51.05,13.97) v2(51.05,12.92) v2(52.07,13.97) v2(52.07,12.92) v2(53.09,13.97) v2(53.09,12.92) v2(53.59,10.63) v2(53.59,8.85) v2(54.74,31.58) v2(56.13,49.15) v2(56.13,48.09) v2(56.31,31.58) v2(57.15,49.15) v2(57.15,48.09) v2(58.17,49.15) v2(58.17,48.09) v2(60.07,25.87) v2(60.07,8.22) v2(60.27,56.04) v2(61.34,16.89) v2(61.34,15.84) v2(61.72,27.39) v2(61.85,8.22) v2(62.36,16.89) v2(62.36,15.84) v2(63.37,16.89) v2(63.37,15.84) v2(64.77,35.27) v2(68.45,6.44) v2(68.45,5.38) v2(68.96,44.54) v2(69.47,6.44) v2(69.47,5.38) v2(69.74,56.04) v2(70.49,6.44) v2(70.49,5.38) v2(70.99,50.13) v2(73.15,33.15) v2(73.15,32.09) v2(74.17,33.15) v2(74.17,32.09) v2(74.62,50.13) v2(74.89,18) v2(74.89,16.98) v2(74.89,15.96) v2(75.18,33.15) v2(75.18,32.09) v2(75.95,18) v2(75.95,16.98) v2(75.95,15.96) v2(77.72,38.7) v2(78.61,56.09) v2(79.62,38.7)
VCC3V3: length 208.9
  Top Layer w0.203: v3(34.61,29.04) 34.61,28.98 34.36,28.73 33.71,28.73 ; v2(66.93,30.57) 66.93,29.43 U20.13 66.93,29.41 66.93,28.79 66.54,28.41 65.98,28.41 ; U8.48 48.75,22.33 49.91,21.17 49.91,20.66 v2(48.77,19.52) ; v2(40.39,43.01) 40.39,49.62 38.99,51.02 ESP01S.2 ; v2(50.03,33.99) 49.99,33.99 49.32,33.32 ; C35.1 C34.1 27.79,27.73 29.04,27.73 ; v2(28.94,28.54) 28.94,27.83 29.04,27.73 ; U20.2 65.98,28.41 ; 65.98,28.41 66.04,28.34 66.04,27.52 65.93,27.41 U20.4 ; v2(55.12,43.65) 55.12,46.06 54.63,46.55 U11.5 ; v2(40.77,32.09) 40.43,31.75 U8.19 ; 29.04,27.73 31.31,27.73 ; R4.2 73.64,43.93 v2(73.66,43.93) 72.1,42.37 R32.2 ; U8.32 36.82,22.82 v2(35.31,22.82) ; U8.1 48.77,34.73 48.77,33.87 49.32,33.32 ; v2(73.41,38.31) 73.14,38.05 R31.2 ; U12.5 37.42,10.93 v2(36.7,11.64) ; U8.13 42.75,36.07 42.75,36.07 42.75,36.49 42.75,36.5 42.75,36.87 42.82,36.94 v2(42.82,36.97) ; v2(68.87,20.63) 70.45,20.63 U9.8 70.54,20.66 71.75,20.66 72.26,21.17 72.26,24.09 71.85,24.5 U9.5 v2(68.87,24.5) ; 49.32,33.32 49.89,32.75 U8.64 ; v2(33.53,43.01) 33.53,49.11 27.52,55.12 27.52,55.78
  Top Layer w0.61: U6.2 U6.4 C14.2 C15.2 ; 5V.1 5V.2 5V.3
  Bottom Layer w0.203: R24.1 23.24,53.68 25.4,51.52 28.07,51.52 35.94,43.65 v2(35.94,43.01) ; v2(59.82,32.98) 60.45,32.35 R22.1 R21.1 R20.1 ; v2(50.03,33.99) 50.61,34.57 51.31,34.57 ; v2(61.5,43.57) 61.55,43.62 R19.1 R23.1 ; C36.1 67.31,32.85 66.93,32.47 v2(66.93,30.57) ; v2(40.77,32.09) 40.77,32.67 40.08,33.35 40.08,34.71 40.13,34.76 40.13,34.96 39,36.09 C44.1 39.87,36.97 v2(42.82,36.97) ; v2(58.93,18.38) C40.1 C39.1 58.02,21.21 U21.8 60.56,21.28 61.07,21.28 61.21,21.42 61.21,22.31 61.02,22.51 U21.6 ; v3(34.61,29.04) 33.29,27.73 32.43,27.73 30.48,29.68 29.21,29.68 28.94,29.41 v2(28.94,28.54) ; R14.2 74.03,22.58 v2(74.04,22.57) ; v2(48.77,19.52) 48.77,18.69 C29.1 ; v2(67.18,24.73) 67.18,23.85 R29.2 ; v2(62.99,41.62) 62.99,40.66 C33.1 64.9,40.6 66.17,41.87 68.45,41.87 69,42.41 72.04,42.41 ; R27.1 67.17,20.02 v2(67.18,20.03) 67.18,21.16 R28.2 ; v2(34.35,20.92) C43.1 34.35,21.87 v2(35.31,22.82)
  Bottom Layer w0.254: D7.1 C31.2 ; C31.2 30.54,34.61 BUZZER1.1 ; C31.2 v2(30.54,31.71)
  Bottom Layer w0.305: R16.2 60.33,3.39 56.13,3.39 54.36,1.61 NRF24L01.7 51.94,2.88 44.32,2.88 41.66,5.55 v2(41.66,6.18)
  vias: v2(22.56,33.23) v2(22.56,32.6) v2(23.19,33.23) v2(23.19,32.6) v2(23.82,33.23) v2(23.82,32.6) v2(34.42,43.01)
VCC24V: length 8.4
  Top Layer w0.61: U7.7 1.78,45.81 1.09,45.12 1.09,43.95 1.91,43.14 3.17,43.14 3.88,42.44 C22.2
(no net):
  vias: v1(4,54) v1(4,4) v1(81,54) v1(81,4)
ACCEL_CS: length 8.7
  Top Layer w0.203: U8.20 36.78,31.25 v2(36.75,31.28) ; U19.14 35.27,27.23 v2(36.45,28.41)
  Bottom Layer w0.203: v2(36.75,31.28) 36.58,31.11 36.58,31.08 36.45,30.95 v2(36.45,28.41)
ACCEL_INT: length 25.5
  Top Layer w0.203: U19.16 32.51,29.16 v3(32.5,29.17) ; v2(43.94,38.19) 44.25,37.88 44.25,34.71 44.21,34.67
  Bottom Layer w0.203: v3(32.5,29.17) 32.88,29.55 33.66,29.55 34.18,30.08 34.18,36.55 35.71,38.09 43.84,38.09 v2(43.94,38.19)
ADC_IN1: length 47.9
  Top Layer w0.203: U8.8 v2(45.25,32.85)
  SIG w0.203: v2(45.25,32.85) 40.3,27.9 37.59,27.9 30.61,20.92 12.19,20.92 11.56,20.28 11.56,18.38 12.18,17.75 14.85,17.75 GND.5
ADC_IN2: length 46.3
  Top Layer w0.203: U8.9 44.75,33.53 v2(44.45,33.23)
  SIG w0.203: GND.6 12.06,16.6 10.92,17.74 10.92,20.66 11.68,21.42 30.35,21.42 37.47,28.54 39.75,28.54 v2(44.45,33.23)
BMI088_MISO: length 10.8
  Top Layer w0.203: 33.06,29.2 33.06,26.85 33.15,26.76 33.69,26.76 33.71,26.73 ; 33.06,29.2 33.1,29.23 U19.10 ; 33.06,29.2 33.06,30.1 33.13,30.17 39.21,30.17
BMI088_MOSI: length 5.5
  Top Layer w0.203: U8.23 39.23,29.73 33.71,29.73
BMI088_SCK: length 7
  Top Layer w0.203: 39.21,30.67 32.87,30.67 32.51,30.31 U19.8
BUTT1: length 39.6
  Top Layer w0.203: v2(49.47,37.74) 47.75,36.03 U8.3 ; BUTT1.2 BUTT1.1 77.76,36.6 C41.1 74.88,36.55 R31.1 69.99,38.57 v2(58.8,38.57)
  SIG w0.203: v2(49.47,37.74) 50.8,39.08 58.29,39.08 v2(58.8,38.57)
BUTT2: length 40.2
  Top Layer w0.203: BUTT2.1 BUTT2.2 77.76,40.92 C42.1 72.06,40.92 R32.1 70.73,39.58 v2(58.8,39.58) ; v2(48.01,37.43) 47.25,36.67 U8.4
  SIG w0.203: v2(58.8,39.58) 50.29,39.58 48.13,37.43 v2(48.01,37.43)
BUZZ: length 12.6
  Top Layer w0.254: U8.26 39.24,28.26 37.69,28.26 37.59,28.16 v2(37.59,27.01)
  Bottom Layer w0.254: v2(37.59,27.01) 36.96,26.38 R15.1
CAN1_H: length 42.6
  Top Layer w0.203: CN11.2 65.66,52.83 v2(65.66,50.89) ; CN7.2 75.18,52.83 v2(75.18,51.02) ; CN10.2 46.61,52.83 v2(46.61,51.02) ; v2(56.13,50.89) 56.13,52.83 CN3.2 ; U11.7 52.69,47.81 R10.2 v2(52.28,50.89) ; D23.2 48.64,49.13 v2(48.64,50.89)
  SIG w0.203: v2(75.18,51.02) 75.06,50.89 v2(65.66,50.89) v2(56.13,50.89) v2(52.28,50.89) v2(48.64,50.89) 46.74,50.89 v2(46.61,51.02)
CAN1_L: length 41.2
  Top Layer w0.203: CN7.1 73.9,52.82 v2(73.9,51.69) ; D23.1 49.93,51.62 v2(49.89,51.65) ; CN11.1 v2(64.4,51.65) ; CN3.1 54.87,51.66 v2(54.86,51.65) ; v2(53.81,51.65) 53.81,48.24 R10.1 53.34,47.78 U11.6 ; CN10.1 v2(45.35,51.65)
  SIG w0.203: v2(73.9,51.69) 73.86,51.65 v2(64.4,51.65) v2(54.86,51.65) v2(53.81,51.65) v2(49.89,51.65) v2(45.35,51.65)
CAN1_RX: length 14.9
  Top Layer w0.203: U11.4 53.97,43.66 53.97,32.47 52.76,31.25 50.79,31.25
CAN1_TX: length 15.2
  Top Layer w0.203: 50.8,31.76 52.55,31.76 53.47,32.68 53.47,41.54 53.25,41.75 52.31,41.75 52.04,42.02 52.04,43.68
CAN2_H: length 43.3
  Top Layer w0.203: CN17.2 38.43,5.18 v2(38.43,6.9) 39.67,8.13 R11.2 39.25,9.4 U12.7 ; CN16.2 v2(28.8,6.95) ; CN15.2 19.1,6.92 v2(19.08,6.95) ; v2(34.85,6.95) 34.81,6.98 34.81,9.22 ; v2(9.41,6.95) CN14.2
  SIG w0.203: v2(9.41,6.95) v2(19.08,6.95) v2(28.8,6.95) v2(34.85,6.95) 38.38,6.95 v2(38.43,6.9)
CAN2_L: length 42.3
  Top Layer w0.203: 33.51,9.22 33.57,9.16 v2(33.57,6.31) ; 30.05,5.12 v2(30.05,6.31) ; CN15.1 v2(20.35,6.31) ; U12.6 38.6,9.42 R11.1 36.58,7.39 v2(36.58,6.31) ; CN14.1 10.67,5.13 v2(10.67,6.31) ; CN17.1 39.75,5.13 v2(39.75,6.31)
  SIG w0.203: v2(39.75,6.31) v2(36.58,6.31) v2(33.57,6.31) v2(30.05,6.31) v2(20.35,6.31) v2(10.67,6.31)
CAN2_RX: length 12
  Top Layer w0.203: 41.21,23.17 41.21,16.4 40.39,15.58 38.15,15.58 37.95,15.38 U12.4
CAN2_TX: length 10.1
  Top Layer w0.203: U12.1 39.9,14.33 41.71,16.14 41.71,23.17
GYRO_CS: length 13.8
  Top Layer w0.203: 31.31,28.73 v2(30.1,28.73) ; v2(35.72,29.13) 35.84,29.25 U8.24
  Bottom Layer w0.203: v2(35.72,29.13) 35.72,28.07 34.42,26.76 30.48,26.76 30.1,27.14 v2(30.1,28.73)
GYRO_INT: length 21.5
  Top Layer w0.203: U19.12 35.06,28.23 v3(35.16,28.34) ; 43.71,34.67 43.76,34.72 43.76,37.2 v2(43.44,37.53)
  Bottom Layer w0.203: v2(43.44,37.53) 35.92,37.53 35.16,36.78 v3(35.16,28.34)
IMU_SCL: length 26.8
  Top Layer w0.203: v2(62.87,29.69) 64.12,29.69 U20.1 ; v2(62.87,29.69) 62.75,29.81 50.85,29.81 50.77,29.73 ; v2(62.87,29.69) 62.87,29.75
  SIG w0.203: v2(62.87,24.73) 62.82,24.78 62.82,29.64 v2(62.87,29.69)
  Bottom Layer w0.203: v2(62.87,24.73) 64.78,24.73 R29.1 64.99,23.16 U21.4
IMU_SDA: length 29.5
  Top Layer w0.203: 64.01,30.25 64.59,30.25 U20.16 ; 64.01,30.25 50.79,30.25 ; 64.01,30.25 v2(64.01,30.31)
  SIG w0.203: v2(65.79,22.57) 65.41,22.57 64.01,23.96 v2(64.01,30.31)
  Bottom Layer w0.203: 65.66,21.18 R28.1 ; 65.66,21.18 64.33,22.51 U21.3 ; 65.66,21.18 65.79,21.31 v2(65.79,22.57)
IO1: length 31.4
  Top Layer w0.203: U8.51 47.49,26.25 v2(47.05,26.69) ; v2(38.11,22.05) 34.06,18 26.65,18 26.64,17.98 25.68,17.98 25.67,18 25.02,18 GND.2
  Bottom Layer w0.203: 38.16,22.12 40.26,24.22 44.58,24.22 v2(47.05,26.69)
IO2: length 29.4
  Top Layer w0.203: GND.1 27.43,15.33 32.26,15.33 39.22,22.29 39.22,22.31 39.35,22.44 v2(39.37,22.44) ; v2(47.37,25.36) 47.76,25.75 U8.50
  Bottom Layer w0.203: v2(39.37,22.44) 40.64,23.71 45.72,23.71 v2(47.37,25.36)
IO3: length 35.5
  Top Layer w0.203: v2(46.79,27.65) 47.19,27.25 50.75,27.25 U8.53
  Bottom Layer w0.203: v2(46.79,27.65) 43.87,24.73 40,24.73 30.61,15.33 22.22,15.33 21.08,16.47 GND.3
IO4: length 37.5
  Top Layer w0.203: U8.57 v2(47.37,29.25)
  Bottom Layer w0.203: GND.4 19.94,18 20.59,18 20.6,17.98 32.37,17.98 39.75,25.36 43.48,25.36 v2(47.37,29.25)
LED1: length 37.7
  Top Layer w0.203: U8.2 48.25,35.89 49.01,36.65 v2(49.16,36.65)
  Bottom Layer w0.203: R30.1 35.17,45.94 48.9,45.94 50.29,44.54 50.29,37.3 49.64,36.65 v2(49.16,36.65)
NRST: length 49.5
  Top Layer w0.203: 75.93,49.24 75.93,48.02 C17.2 72.06,47.02 R4.1 71,47.07 v2(70.33,47.74) ; v2(46.86,33.11) 46.1,33.11 45.75,33.46 U8.7
  SIG w0.203: v2(70.33,47.74) 68.33,49.75 61.09,49.75 59.94,48.6 59.94,34.63 58.42,33.11 v2(46.86,33.11)
OLED_SCL: length 51.3
  Top Layer w0.203: v2(43.31,26.63) 43.19,26.75 U8.29
  SIG w0.203: v2(43.31,26.63) 46.61,23.33 47.37,23.33 59.06,11.64 v2(74.55,11.64)
  Bottom Layer w0.203: v2(74.55,11.64) OLED.3
OLED_SDA: length 48.7
  Top Layer w0.203: U8.55 54.26,28.25 54.74,27.77 v2(54.74,25.36)
  SIG w0.203: v2(77.09,12.03) 76.33,12.79 60.45,12.79 54.74,18.5 v2(54.74,25.36)
  Bottom Layer w0.203: v2(77.09,12.03) OLED.4
OSC_IN: length 10.1
  Top Layer w0.203: 46.71,34.67 46.71,39.8 46.85,39.94 46.79,39.94 46.04,40.68 46.04,42.95 47,43.9 X1.1
OSC_OUT: length 10.2
  Top Layer w0.203: X1.3 44.82,42.22 C2.2 44.88,39.88 44.88,39.13 45.09,38.92 46.13,38.92 46.26,38.79 46.26,38.56 46.12,38.42 45.52,38.42 45.39,38.29 45.39,37.93 45.53,37.78 46.15,37.78 46.25,37.68 46.25,34.71 46.21,34.67
POWER: length 4.4
  Top Layer w1.524: CN1.2 11.88,26.42 D6.2
SDIO_CK: length 43.9
  Top Layer w0.203: U8.28 39.29,27.25 39.31,27.27 42.04,27.27 42.8,28.03 v2(42.8,28.28)
  SIG w0.203: v2(42.8,28.28) 57.78,28.28 62.61,33.11 62.61,37.68 65.79,40.86 v2(65.79,43.44)
  Bottom Layer w0.203: v2(65.79,43.44) D19.2 66.78,43.51 72.04,43.51
SDIO_CMD: length 30.4
  Top Layer w0.203: U8.54 52.59,27.75 v2(52.87,27.47)
  SIG w0.203: v2(63.31,36.92) 63.13,36.74 63.13,32.87 57.73,27.47 v2(52.87,27.47)
  Bottom Layer w0.203: v2(63.31,36.92) 63.31,37.81 R20.2 63.37,38.06 66.09,40.78 D13.2 67.24,41.31 72.04,41.31
SDIO_D0: length 50.7
  Top Layer w0.203: v2(43.31,29.42) 44.21,28.52 44.21,23.17
  SIG w0.203: v2(63.05,44.92) 64.77,43.2 64.77,40.47 62.1,37.81 62.1,33.23 58.8,29.93 46.23,29.93 45.72,29.42 v2(43.31,29.42)
  Bottom Layer w0.203: v2(63.05,44.92) R19.2 63.22,46.1 66.71,46.1 66.74,46.06 67.44,46.06 67.79,45.71 72.04,45.71
SDIO_D1: length 51.7
  Top Layer w0.203: U8.40 44.75,23.25 v2(44.75,30.24)
  SIG w0.203: v2(44.75,30.24) 44.96,30.44 58.55,30.44 61.47,33.36 61.47,38.31 62.36,39.2 62.36,47.02 v2(63.05,47.71)
  Bottom Layer w0.203: v2(63.05,47.71) R23.2 63.08,48.76 D14.2 66.74,48.73 67.56,48.73 67.93,48.36 67.93,46.96 68.07,46.81 72.04,46.81
SDIO_D2: length 41.5
  Top Layer w0.203: v2(41.53,27.94) 41.33,27.73 39.27,27.73 U8.27
  SIG w0.203: v2(41.53,27.94) 41.82,27.65 43.69,27.65 45.34,26 58.1,26 v2(63.69,31.58)
  Bottom Layer w0.203: 72.04,39.11 72.01,39.08 68.58,39.08 68.44,38.93 68.44,37.19 D18.2 66.23,35.46 63.12,32.35 R22.2 63.69,31.71 v2(63.69,31.58)
SDIO_D3: length 29.4
  Top Layer w0.203: v2(53.85,26.76) 50.8,26.76
  SIG w0.203: v2(63.69,34.12) 63.69,32.54 57.91,26.76 v2(53.85,26.76)
  Bottom Layer w0.203: 72.04,40.21 68.57,40.21 66.71,38.35 D17.2 66.03,38.12 R21.2 63.69,34.5 v2(63.69,34.12)
SERVO1: length 50
  Top Layer w0.203: v2(45.04,21.47) 45.25,21.68 U8.41
  Bottom Layer w0.203: v2(45.04,21.47) 44.2,20.63 44.2,11.45 43.76,11.01 7.11,11.01 SERV1.3
SERVO2: length 51.7
  Top Layer w0.203: 45.71,23.17 45.71,21.16 v2(45.21,20.66)
  Bottom Layer w0.203: SERV2.3 7.87,9.99 44.2,9.99 44.83,10.63 44.83,20.28 v2(45.21,20.66)
SPI2_CE: length 24
  Top Layer w0.203: NRF24L01.6 50.67,5.93 48.9,7.71 45.85,7.71 44.58,8.98 44.58,18.88 46.21,20.52 46.21,23.17
SPI2_CLK: length 21.4
  Top Layer w0.203: v2(47.37,5.68) 48.13,4.91 NRF24L01.4 ; v2(43.9,8.89) 43.75,9.04 U8.38
  SIG w0.203: v2(43.9,8.89) 43.81,8.8 43.81,8.6 46.74,5.68 v2(47.37,5.68)
SPI2_CSN: length 26.5
  Top Layer w0.203: NRF24L01.5 49.28,3.01 49.28,5.42 47.88,6.82 44.83,6.82 43.25,8.4 U8.37
SPI2_MISO: length 20.5
  Top Layer w0.203: U8.35 42.25,7.5 NRF24L01.2
SPI2_MOSI: length 24.4
  Top Layer w0.203: U8.36 42.75,7.88 44.83,5.8 45.72,5.8 46.86,4.66 46.86,2.88 NRF24L01.3
SWCLK: length 39.5
  Top Layer w0.203: U8.49 50.73,25.23 49.78,25.23 49.4,24.85 49.4,22.57 62.48,9.49 79.66,9.49 CLK|DIO|GND.3
SWDIO: length 38.8
  Top Layer w0.203: 47.71,23.29 47.71,23.17 47.71,23.17 47.71,20.45 v2(47.88,20.28) ; v2(78.1,10.76) CLK|DIO|GND.2
  SIG w0.203: v2(78.1,10.76) 58.93,10.76 49.4,20.28 v2(47.88,20.28)
TTL_DM: length 6.9
  Top Layer w0.203: U9.2 77.47,21.96 77.6,21.84 77.6,21.33 77.76,21.17 TTL_U2.A7 78.82,21.2 v3(80.01,21.2) ; v3(80.03,20.19) 80.01,20.17 TTL_U2.B7
  SIG w0.203: v3(80.03,20.19) 80.03,21.19 v3(80.01,21.2)
TTL_DP: length 7.1
  Top Layer w0.203: TTL_U2.B6 78.83,21.71 80.39,21.71 80.52,21.58 80.52,20.82 80.39,20.69 78.82,20.69 TTL_U2.A6 76.08,20.67 U9.1
UART4_RX_ESP: length 24.9
  Top Layer w0.203: U8.15 41.75,37.33 39.05,40.03 39.05,49.17 37.72,50.51 34.16,50.51 ESP01S.8
UART4_TX_ESP: length 23.5
  Top Layer w0.203: ESP01S.1 37.72,54.57 37.72,51.4 39.75,49.36 39.75,40.09 42.25,37.59 U8.14
USART2_RX: length 39.1
  Top Layer w0.203: U9.6 v2(52.45,23.23) ; U8.17 40.03,32.75 40.77,33.49 40.74,33.49 v2(40.64,33.58)
  Bottom Layer w0.203: v2(40.64,33.58) 42.01,32.22 47.88,32.22 48.64,31.46 48.64,26.38 51.78,23.23 v2(52.45,23.23)
USART2_TX: length 39.4
  Top Layer w0.203: v2(48.83,24.82) 48.61,24.6 46.74,24.6 45.85,25.49 45.85,31.46 45.47,31.84 42.93,31.84 41.25,33.51 U8.16 ; U9.7 52.29,21.96 51.82,22.44 v2(51.69,22.44)
  Bottom Layer w0.203: v2(48.83,24.82) 50.02,23.63 50.75,23.63 51.05,23.33 51.05,22.64 51.26,22.44 v2(51.69,22.44)
USART3_RX_DT7: length 47
  Top Layer w0.203: v2(61.59,25.49) 60.57,24.47 51.69,24.47 v2(50.29,23.08) ; v2(41.78,31.54) 41.2,30.96 41.2,29.22 40.72,28.74 39.26,28.74 U8.25
  Bottom Layer w0.203: v2(61.59,25.49) 61.71,25.61 71.13,25.61 R14.1 74.17,25.86 Q1.3 ; v2(41.78,31.54) 47.79,31.54 48.13,31.2 48.13,24.6 49.66,23.08 v2(50.29,23.08)
USB_DM: length 34.5
  Top Layer w0.203: USB.A7 61.74,6.24 61.74,4.8 61.59,4.66 60.96,4.66 60.72,4.9 USB.B7 60.72,7.04 60.79,7.11 60.79,8.39 59.56,9.61 59.16,9.61 59.02,9.47 59.02,8.87 58.87,8.72 58.55,8.72 58.41,8.87 58.41,9.47 58.26,9.61 48.77,9.61 46.82,11.56 46.82,21.97 46.71,22.09 46.71,23.17
USB_DP: length 34.5
  Top Layer w0.203: v3(62.25,5.16) 62.22,5.18 USB.B6 ; 47.21,23.17 47.21,22 47.18,21.97 47.18,11.71 48.92,9.97 59.71,9.97 61.15,8.53 61.15,7.11 61.22,7.04 USB.A6 61.22,5.18 v3(61.23,5.17)
  SIG w0.203: v3(61.23,5.17) 62.23,5.17 v3(62.25,5.16)
  Bottom Layer w0.203: R16.1 62.25,3.03 v3(62.25,5.16)
WS2812: length 14.7
  Top Layer w0.203: LED2.4 58.78,32.58 v2(57.78,31.58) ; v2(56.13,28.84) 56.04,28.75 U8.56
  Bottom Layer w0.203: v2(57.78,31.58) 57.78,29.3 57.4,28.92 56.21,28.92 v2(56.13,28.84)
$3N10170: length 2.9
  Top Layer w0.61: U7.1 9.3,44.25 C24.1
$3N10572: length 16.3
  Top Layer w0.61: L1.1 14.35,41.74 14.1,41.49 D1.2 11.72,40.47 6.98,40.47 6.03,41.43 6.03,42.41 U7.8
$3N10716: length 7.8
  Top Layer w0.203: R7.1 R8.2 9.3,53.53 U7.4
$3N11994: length 5.5
  Top Layer w0.203: U8.30 37.34,26.25 v2(35.94,24.85)
  Bottom Layer w0.203: C27.1 v2(35.94,24.85)
$3N17339: length 6.6
  Top Layer w0.203: U18.4 4.83,34.76 3.94,35.65 3.94,36.66 R12.1
$3N17600: length 4
  Bottom Layer w0.203: R13.1 76.45,30.82 DT7.1
$3N17601: length 2.4
  Bottom Layer w0.203: Q1.1 73.22,30.63 R13.2
$3N17854: length 5.2
  Bottom Layer w0.254: Q2.3 25.27,32.82 D7.2 25.24,35.21 BUZZER1.2
$3N17986: length 2.2
  Bottom Layer w0.254: 26.22,28.44 26.22,26.71 R15.2
$3N19919: length 2.2
  Top Layer w0.203: 3V3#2.2 21.46,55.8 v2(21.46,54.83)
  Bottom Layer w0.203: R24.2 21.47,54.82 v2(21.46,54.83)
$3N19978: length 2.2
  Top Layer w0.203: v2(16.76,54.83) 16.76,55.8 5V#2.2
  Bottom Layer w0.203: v2(16.76,54.83) 16.76,53.69 R25.2
$3N20666: length 3.8
  Top Layer w0.203: U20.12 67.44,28.92 69.46,28.92 v2(69.6,28.78)
  Bottom Layer w0.203: v2(69.6,28.78) 69.6,27.84 C37.2
$3N20667: length 4.3
  Top Layer w0.203: U20.8 67.56,26.89 v2(67.82,26.63)
  Bottom Layer w0.203: C37.1 69.53,26.38 68.07,26.38 v2(67.82,26.63)
$3N20697: length 3.3
  Top Layer w0.203: U20.10 67.45,27.93 67.89,27.93 v2(68.33,28.36)
  Bottom Layer w0.203: C38.2 69.15,30.12 68.33,29.3 v2(68.33,28.36)
$3N20825: length 2.7
  Bottom Layer w0.203: U21.5 60.19,23.46 R26.1
$3N21033: length 5.1
  Bottom Layer w0.203: U21.2 62.94,21.86 65.67,19.13 R27.2
$3N21210: length 2.1
  Top Layer w0.203: v2(25.92,54.7) LED1.2
  Bottom Layer w0.203: R30.2 v2(25.92,54.7)

## Copper pours and planes (outline as drawn; the poured copper is in the pictures)
+5V on Top Layer: 25.83,50.35 27.75,50.35 27.75,48.66 25.83,48.66
+5V on Top Layer: 29.19,47.53 31.12,47.53 31.12,45.84 29.19,45.84
+5V on POW: 7.11,54.06 77.22,54.06 78.87,52.41 78.87,44.67 24.28,44.67 19.75,40.13 19.75,4.72 18.54,3.52 7.11,3.52 6.98,3.64 6.98,53.94
GND on Top Layer: 0,58 85.09,58 85.09,-0.17 0,-0.17
GND on Bottom Layer: 0,58 85.09,58 85.09,-0.17 0,-0.17
GND on GND1: 1.02,56.98 83.98,56.98 83.98,1.02 1.02,1.02
GND on SIG: -0.13,58.13 85.09,58.13 85.09,-0.17 -0.13,-0.17
GND on POW: 0,58 85.22,58 85.22,-0.17 0,-0.17
GND on GND2: 1.02,56.98 83.98,56.98 83.98,1.02 1.02,1.02
VCC3V3 on Top Layer: 22.22,33.97 24.15,33.97 24.15,32.27 22.22,32.27
VCC3V3 on POW: 25.27,44.28 78.61,44.28 78.74,44.16 78.74,6.56 76.33,4.15 21.46,4.15 20.32,5.29 20.32,39.33
VCC24V on Top Layer: 3.48,42.2 10.08,42.2 10.08,35.7 3.48,35.7
POWER on Top Layer: 13.59,38.95 15.49,38.95 15.49,29.3 13.59,29.3

Small or netless copper shapes (teardrops, artwork), in the pictures only: 379 on Top Layer, 127 on Bottom Layer, 77 on GND1, 74 on SIG, 77 on GND2

## Text on the board
Top Silkscreen Layer: IO/ADC
